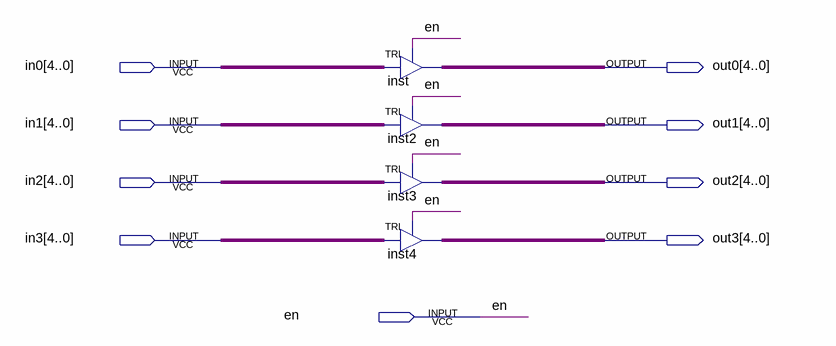
[diagram p0: schematic sheet]
// Quartus schematic tri4RAMs.bdf as structural Verilog: 4 symbols, 9 pins
module tri4RAMs (
  input  [4:0] in0,
  input  [4:0] in1,
  input  [4:0] in2,
  input  [4:0] in3,
  input  en,
  output [4:0] out0,
  output [4:0] out1,
  output [4:0] out2,
  output [4:0] out3
);

  TRI inst[4:0] (.IN(in0), .OE(en), .OUT(out0));
  TRI inst2[4:0] (.IN(in1), .OE(en), .OUT(out1));
  TRI inst3[4:0] (.IN(in2), .OE(en), .OUT(out2));
  TRI inst4[4:0] (.IN(in3), .OE(en), .OUT(out3));
endmodule
